# Altium project PCB_3U_RJ45.PrjPCB
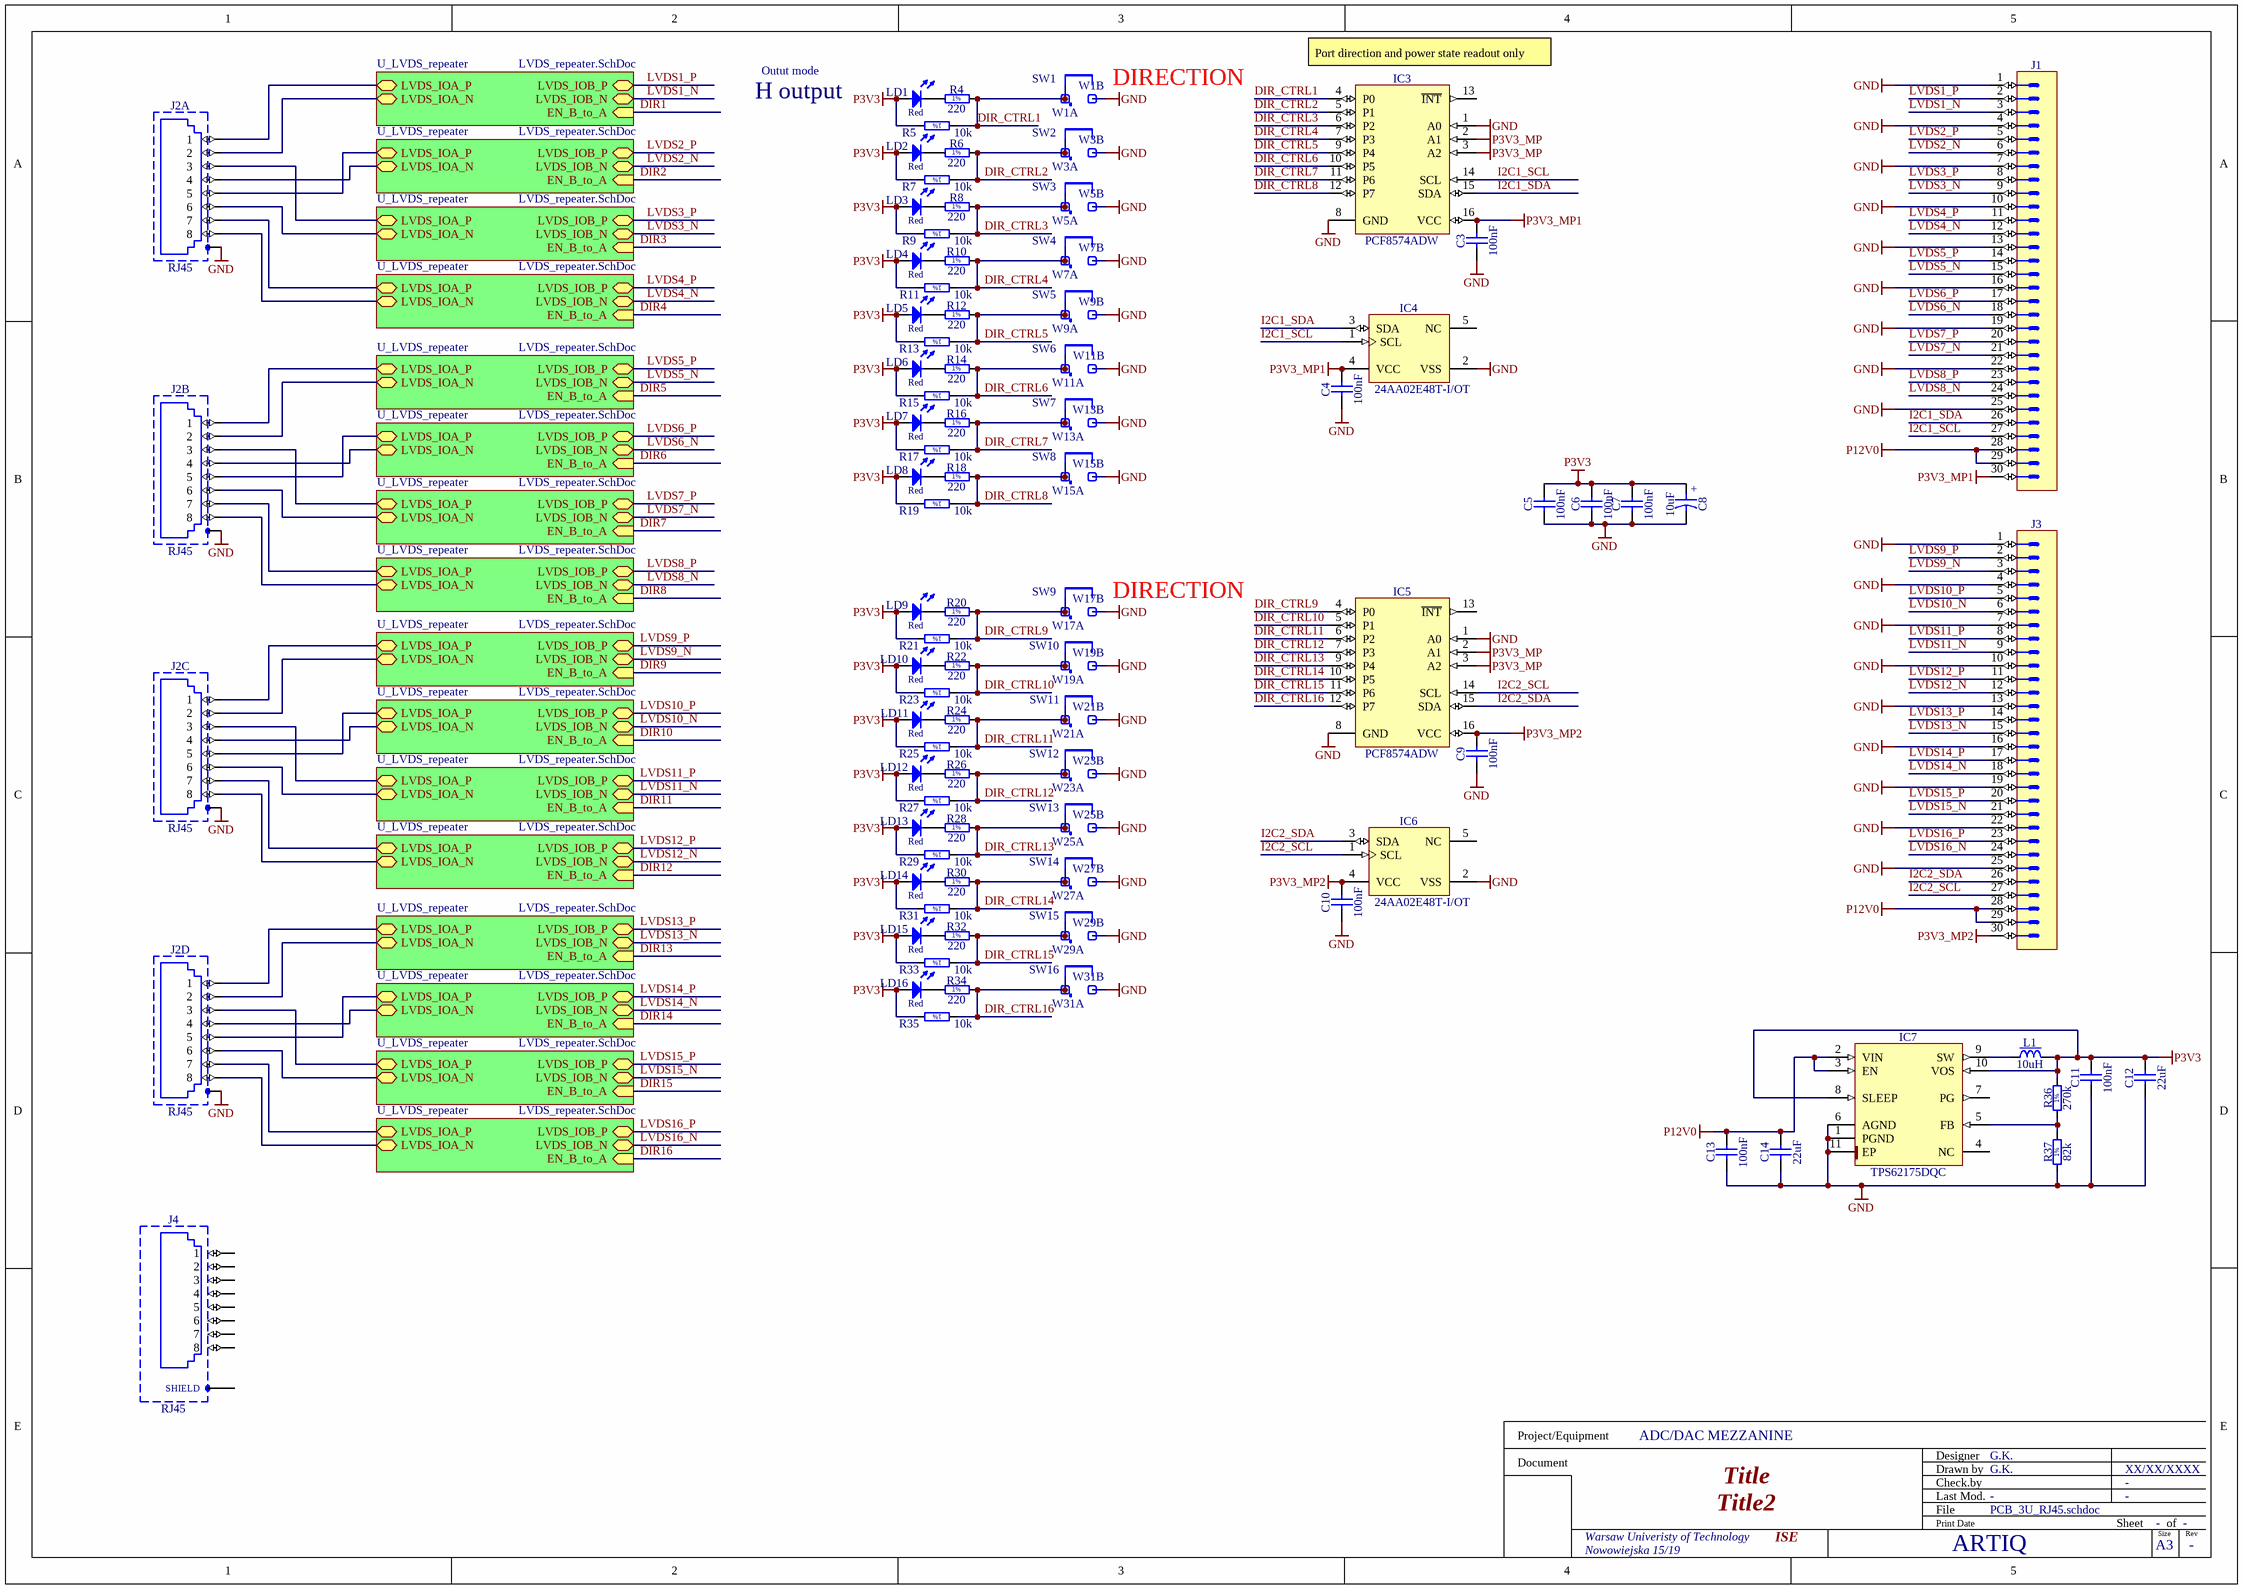
[diagram p0: PCB_3U_RJ45.schdoc]
2 sheets, 232 parts. Net scope: hierarchical (ports join the sheet entries above them; power ports are global).
Board file: PCB_3U_RJ45.PCBDOC
Sheets:
  PCB_3U_RJ45.schdoc
    U_LVDS_repeater = LVDS_repeater.SchDoc
    U_LVDS_repeater = LVDS_repeater.SchDoc
    U_LVDS_repeater = LVDS_repeater.SchDoc
    U_LVDS_repeater = LVDS_repeater.SchDoc
    U_LVDS_repeater = LVDS_repeater.SchDoc
    U_LVDS_repeater = LVDS_repeater.SchDoc
    U_LVDS_repeater = LVDS_repeater.SchDoc
    U_LVDS_repeater = LVDS_repeater.SchDoc
    U_LVDS_repeater = LVDS_repeater.SchDoc
    U_LVDS_repeater = LVDS_repeater.SchDoc
    U_LVDS_repeater = LVDS_repeater.SchDoc
    U_LVDS_repeater = LVDS_repeater.SchDoc
    U_LVDS_repeater = LVDS_repeater.SchDoc
    U_LVDS_repeater = LVDS_repeater.SchDoc
    U_LVDS_repeater = LVDS_repeater.SchDoc
    U_LVDS_repeater = LVDS_repeater.SchDoc

## Sheet PCB_3U_RJ45.schdoc: Title
size 420 x 297 mm; Author: G.K.; CompanyName: WUT; DrawnBy: G.K.; Organization: CERN; Address1: Warsaw Univeristy of Technology; Address2: Nowowiejska 15/19; Revision: -; SheetNumber: -; SheetTotal: -; EDA_Number: ARTIQ; Projet: ADC/DAC MEZZANINE; ModifiedBy: -; CreateDate: XX/XX/XXXX; CheckedDate: -; Title2: Title2; DivGrp: ISE; Designer: G.K.; ModifiedDate: -; ProjectName: ADC/DAC MEZZANINE

### Parts
C3  100nF  [CAPC1005X55N]
C4  100nF  [CAPC1005X55N]
C5  100nF  [CAPC1005X55N]
C6  100nF  [CAPC1005X55N]
C7  100nF  [CAPC1005X55N]
C8  10uF  [CAPAE430X540N]
C9  100nF  [CAPC1005X55N]
C10  100nF  [CAPC1005X55N]
C11  100nF  [CAPC1005X55N]
C12  22uF  [CAPC2012X135N]
C13  100nF  [CAPC1005X55N]
C14  22uF  [CAPC2012X135N]
IC3  PCF8574ADW  [SOIC127P1030X265-16N]
IC4  24AA02E48T-I/OT  [SOT95P280X145-5N]
IC5  PCF8574ADW  [SOIC127P1030X265-16N]
IC6  24AA02E48T-I/OT  [SOT95P280X145-5N]
IC7  TPS62175DQC  [SON50P200X300X80-11N-R94X250]
J1  (no value)  [3M_N2530-6002RB]
J2  RJ45  [TYCO_5406203-3]  (parts A,B,C,D of 4)
J3  (no value)  [3M_N2530-6002RB]
J4  RJ45  [FCI_95678-001LF]
L1  10uH  [IND_MURATA-PS_8400]
LD1  Red  [LED_AVAGO_HSMC-C120]  (value not drawn)
LD2  Red  [LED_AVAGO_HSMC-C120]  (value not drawn)
LD3  Red  [LED_AVAGO_HSMC-C120]  (value not drawn)
LD4  Red  [LED_AVAGO_HSMC-C120]  (value not drawn)
LD5  Red  [LED_AVAGO_HSMC-C120]  (value not drawn)
LD6  Red  [LED_AVAGO_HSMC-C120]  (value not drawn)
LD7  Red  [LED_AVAGO_HSMC-C120]  (value not drawn)
LD8  Red  [LED_AVAGO_HSMC-C120]  (value not drawn)
LD9  Red  [LED_AVAGO_HSMC-C120]  (value not drawn)
LD10  Red  [LED_AVAGO_HSMC-C120]  (value not drawn)
LD11  Red  [LED_AVAGO_HSMC-C120]  (value not drawn)
LD12  Red  [LED_AVAGO_HSMC-C120]  (value not drawn)
LD13  Red  [LED_AVAGO_HSMC-C120]  (value not drawn)
LD14  Red  [LED_AVAGO_HSMC-C120]  (value not drawn)
LD15  Red  [LED_AVAGO_HSMC-C120]  (value not drawn)
LD16  Red  [LED_AVAGO_HSMC-C120]  (value not drawn)
R4  220  [RESC1608X55N]
R5  10k  [RESC1005X40N]
R6  220  [RESC1608X55N]
R7  10k  [RESC1005X40N]
R8  220  [RESC1608X55N]
R9  10k  [RESC1005X40N]
R10  220  [RESC1608X55N]
R11  10k  [RESC1005X40N]
R12  220  [RESC1608X55N]
R13  10k  [RESC1005X40N]
R14  220  [RESC1608X55N]
R15  10k  [RESC1005X40N]
R16  220  [RESC1608X55N]
R17  10k  [RESC1005X40N]
R18  220  [RESC1608X55N]
R19  10k  [RESC1005X40N]
R20  220  [RESC1608X55N]
R21  10k  [RESC1005X40N]
R22  220  [RESC1608X55N]
R23  10k  [RESC1005X40N]
R24  220  [RESC1608X55N]
R25  10k  [RESC1005X40N]
R26  220  [RESC1608X55N]
R27  10k  [RESC1005X40N]
R28  220  [RESC1608X55N]
R29  10k  [RESC1005X40N]
R30  220  [RESC1608X55N]
R31  10k  [RESC1005X40N]
R32  220  [RESC1608X55N]
R33  10k  [RESC1005X40N]
R34  220  [RESC1608X55N]
R35  10k  [RESC1005X40N]
R36  270k  [RESC1608X55N]
R37  82k  [RESC1608X55N]
SW1  Jumper Type1  [JUMPER_BLACK_INSULATED_2.54MM]  (value not drawn)
SW2  Jumper Type1  [JUMPER_BLACK_INSULATED_2.54MM]  (value not drawn)
SW3  Jumper Type1  [JUMPER_BLACK_INSULATED_2.54MM]  (value not drawn)
SW4  Jumper Type1  [JUMPER_BLACK_INSULATED_2.54MM]  (value not drawn)
SW5  Jumper Type1  [JUMPER_BLACK_INSULATED_2.54MM]  (value not drawn)
SW6  Jumper Type1  [JUMPER_BLACK_INSULATED_2.54MM]  (value not drawn)
SW7  Jumper Type1  [JUMPER_BLACK_INSULATED_2.54MM]  (value not drawn)
SW8  Jumper Type1  [JUMPER_BLACK_INSULATED_2.54MM]  (value not drawn)
SW9  Jumper Type1  [JUMPER_BLACK_INSULATED_2.54MM]  (value not drawn)
SW10  Jumper Type1  [JUMPER_BLACK_INSULATED_2.54MM]  (value not drawn)
SW11  Jumper Type1  [JUMPER_BLACK_INSULATED_2.54MM]  (value not drawn)
SW12  Jumper Type1  [JUMPER_BLACK_INSULATED_2.54MM]  (value not drawn)
SW13  Jumper Type1  [JUMPER_BLACK_INSULATED_2.54MM]  (value not drawn)
SW14  Jumper Type1  [JUMPER_BLACK_INSULATED_2.54MM]  (value not drawn)
SW15  Jumper Type1  [JUMPER_BLACK_INSULATED_2.54MM]  (value not drawn)
SW16  Jumper Type1  [JUMPER_BLACK_INSULATED_2.54MM]  (value not drawn)
W1  Test Point  [COMATEL_385.0358.1.02.400]  (value not drawn)  (parts A,B of 2)
W3  Test Point  [COMATEL_385.0358.1.02.400]  (value not drawn)  (parts A,B of 2)
W5  Test Point  [COMATEL_385.0358.1.02.400]  (value not drawn)  (parts A,B of 2)
W7  Test Point  [COMATEL_385.0358.1.02.400]  (value not drawn)  (parts A,B of 2)
W9  Test Point  [COMATEL_385.0358.1.02.400]  (value not drawn)  (parts A,B of 2)
W11  Test Point  [COMATEL_385.0358.1.02.400]  (value not drawn)  (parts A,B of 2)
W13  Test Point  [COMATEL_385.0358.1.02.400]  (value not drawn)  (parts A,B of 2)
W15  Test Point  [COMATEL_385.0358.1.02.400]  (value not drawn)  (parts A,B of 2)
W17  Test Point  [COMATEL_385.0358.1.02.400]  (value not drawn)  (parts A,B of 2)
W19  Test Point  [COMATEL_385.0358.1.02.400]  (value not drawn)  (parts A,B of 2)
W21  Test Point  [COMATEL_385.0358.1.02.400]  (value not drawn)  (parts A,B of 2)
W23  Test Point  [COMATEL_385.0358.1.02.400]  (value not drawn)  (parts A,B of 2)
W25  Test Point  [COMATEL_385.0358.1.02.400]  (value not drawn)  (parts A,B of 2)
W27  Test Point  [COMATEL_385.0358.1.02.400]  (value not drawn)  (parts A,B of 2)
W29  Test Point  [COMATEL_385.0358.1.02.400]  (value not drawn)  (parts A,B of 2)
W31  Test Point  [COMATEL_385.0358.1.02.400]  (value not drawn)  (parts A,B of 2)

### Sub-sheets
U_LVDS_repeater = LVDS_repeater.SchDoc: LVDS_IOA_P (bidir), LVDS_IOA_N (bidir), LVDS_IOB_P (bidir), LVDS_IOB_N (bidir), EN_B_to_A (in)
U_LVDS_repeater = LVDS_repeater.SchDoc: LVDS_IOA_P (bidir), LVDS_IOA_N (bidir), LVDS_IOB_P (bidir), LVDS_IOB_N (bidir), EN_B_to_A (in)
U_LVDS_repeater = LVDS_repeater.SchDoc: LVDS_IOA_P (bidir), LVDS_IOA_N (bidir), LVDS_IOB_P (bidir), LVDS_IOB_N (bidir), EN_B_to_A (in)
U_LVDS_repeater = LVDS_repeater.SchDoc: LVDS_IOA_P (bidir), LVDS_IOA_N (bidir), LVDS_IOB_P (bidir), LVDS_IOB_N (bidir), EN_B_to_A (in)
U_LVDS_repeater = LVDS_repeater.SchDoc: LVDS_IOA_P (bidir), LVDS_IOA_N (bidir), LVDS_IOB_P (bidir), LVDS_IOB_N (bidir), EN_B_to_A (in)
U_LVDS_repeater = LVDS_repeater.SchDoc: LVDS_IOA_P (bidir), LVDS_IOA_N (bidir), LVDS_IOB_P (bidir), LVDS_IOB_N (bidir), EN_B_to_A (in)
U_LVDS_repeater = LVDS_repeater.SchDoc: LVDS_IOA_P (bidir), LVDS_IOA_N (bidir), LVDS_IOB_P (bidir), LVDS_IOB_N (bidir), EN_B_to_A (in)
U_LVDS_repeater = LVDS_repeater.SchDoc: LVDS_IOA_P (bidir), LVDS_IOA_N (bidir), LVDS_IOB_P (bidir), LVDS_IOB_N (bidir), EN_B_to_A (in)
U_LVDS_repeater = LVDS_repeater.SchDoc: LVDS_IOA_P (bidir), LVDS_IOA_N (bidir), LVDS_IOB_P (bidir), LVDS_IOB_N (bidir), EN_B_to_A (in)
U_LVDS_repeater = LVDS_repeater.SchDoc: LVDS_IOA_P (bidir), LVDS_IOA_N (bidir), LVDS_IOB_P (bidir), LVDS_IOB_N (bidir), EN_B_to_A (in)
U_LVDS_repeater = LVDS_repeater.SchDoc: LVDS_IOA_P (bidir), LVDS_IOA_N (bidir), LVDS_IOB_P (bidir), LVDS_IOB_N (bidir), EN_B_to_A (in)
U_LVDS_repeater = LVDS_repeater.SchDoc: LVDS_IOA_P (bidir), LVDS_IOA_N (bidir), LVDS_IOB_P (bidir), LVDS_IOB_N (bidir), EN_B_to_A (in)
U_LVDS_repeater = LVDS_repeater.SchDoc: LVDS_IOA_P (bidir), LVDS_IOA_N (bidir), LVDS_IOB_P (bidir), LVDS_IOB_N (bidir), EN_B_to_A (in)
U_LVDS_repeater = LVDS_repeater.SchDoc: LVDS_IOA_P (bidir), LVDS_IOA_N (bidir), LVDS_IOB_P (bidir), LVDS_IOB_N (bidir), EN_B_to_A (in)
U_LVDS_repeater = LVDS_repeater.SchDoc: LVDS_IOA_P (bidir), LVDS_IOA_N (bidir), LVDS_IOB_P (bidir), LVDS_IOB_N (bidir), EN_B_to_A (in)
U_LVDS_repeater = LVDS_repeater.SchDoc: LVDS_IOA_P (bidir), LVDS_IOA_N (bidir), LVDS_IOB_P (bidir), LVDS_IOB_N (bidir), EN_B_to_A (in)

### Nets
GND: C3.1 C4.1 C5.1 C6.1 C7.1 C8.2 C9.1 C10.1 C11.1 C12.1 C13.1 C14.1 IC3.1(A0) IC3.8(GND) IC4.2(VSS) IC5.1(A0) IC5.8(GND) IC6.2(VSS) IC7.1(PGND) IC7.6(AGND) IC7.11(EP) J1.1 J1.4 J1.7 J1.10 J1.13 J1.16 J1.19 J1.22 J1.25 J2.SH J3.1 J3.4 J3.7 J3.10 J3.13 J3.16 J3.19 J3.22 J3.25 R37.1 W1.2 W3.2 W5.2 W7.2 W9.2 W11.2 W13.2 W15.2 W17.2 W19.2 W21.2 W23.2 W25.2 W27.2 W29.2 W31.2
P3V3: C5.2 C6.2 C7.2 C8.1 C11.2 C12.2 IC7.8(SLEEP) IC7.10(VOS) L1.2 LD1.2(A) LD2.2(A) LD3.2(A) LD4.2(A) LD5.2(A) LD6.2(A) LD7.2(A) LD8.2(A) LD9.2(A) LD10.2(A) LD11.2(A) LD12.2(A) LD13.2(A) LD14.2(A) LD15.2(A) LD16.2(A) R5.2 R7.2 R9.2 R11.2 R13.2 R15.2 R17.2 R19.2 R21.2 R23.2 R25.2 R27.2 R29.2 R31.2 R33.2 R35.2 R36.2
P3V3_MP: IC3.2(A1) IC3.3(A2) IC5.2(A1) IC5.3(A2)
P3V3_MP1: C3.2 C4.2 IC3.16(VCC) IC4.4(VCC) J1.30
P3V3_MP2: C9.2 C10.2 IC5.16(VCC) IC6.4(VCC) J3.30
P12V0: C13.2 C14.2 IC7.2(VIN) IC7.3(EN) J1.28 J1.29 J3.28 J3.29
DIR_CTRL1: IC3.4(P0) R4.2 R5.1 SW1.1 W1.1
DIR_CTRL2: IC3.5(P1) R6.2 R7.1 SW2.1 W3.1
DIR_CTRL3: IC3.6(P2) R8.2 R9.1 SW3.1 W5.1
DIR_CTRL4: IC3.7(P3) R10.2 R11.1 SW4.1 W7.1
DIR_CTRL5: IC3.9(P4) R12.2 R13.1 SW5.1 W9.1
DIR_CTRL6: IC3.10(P5) R14.2 R15.1 SW6.1 W11.1
DIR_CTRL7: IC3.11(P6) R16.2 R17.1 SW7.1 W13.1
DIR_CTRL8: IC3.12(P7) R18.2 R19.1 SW8.1 W15.1
DIR_CTRL9: IC5.4(P0) R20.2 R21.1 SW9.1 W17.1
DIR_CTRL10: IC5.5(P1) R22.2 R23.1 SW10.1 W19.1
DIR_CTRL11: IC5.6(P2) R24.2 R25.1 SW11.1 W21.1
DIR_CTRL12: IC5.7(P3) R26.2 R27.1 SW12.1 W23.1
DIR_CTRL13: IC5.9(P4) R28.2 R29.1 SW13.1 W25.1
DIR_CTRL14: IC5.10(P5) R30.2 R31.1 SW14.1 W27.1
DIR_CTRL15: IC5.11(P6) R32.2 R33.1 SW15.1 W29.1
DIR_CTRL16: IC5.12(P7) R34.2 R35.1 SW16.1 W31.1
I2C1_SCL: IC3.14(SCL) IC4.1(SCL) J1.27
I2C1_SDA: IC3.15(SDA) IC4.3(SDA) J1.26
I2C2_SCL: IC5.14(SCL) IC6.1(SCL) J3.27
I2C2_SDA: IC5.15(SDA) IC6.3(SDA) J3.26
LVDS1_N: J1.3 ; sheet U_LVDS_repeater/LVDS_IOB_N
LVDS1_P: J1.2 ; sheet U_LVDS_repeater/LVDS_IOB_P
LVDS2_N: J1.6 ; sheet U_LVDS_repeater/LVDS_IOB_N
LVDS2_P: J1.5 ; sheet U_LVDS_repeater/LVDS_IOB_P
LVDS3_N: J1.9 ; sheet U_LVDS_repeater/LVDS_IOB_N
LVDS3_P: J1.8 ; sheet U_LVDS_repeater/LVDS_IOB_P
LVDS4_N: J1.12 ; sheet U_LVDS_repeater/LVDS_IOB_N
LVDS4_P: J1.11 ; sheet U_LVDS_repeater/LVDS_IOB_P
LVDS5_N: J1.15 ; sheet U_LVDS_repeater/LVDS_IOB_N
LVDS5_P: J1.14 ; sheet U_LVDS_repeater/LVDS_IOB_P
LVDS6_N: J1.18 ; sheet U_LVDS_repeater/LVDS_IOB_N
LVDS6_P: J1.17 ; sheet U_LVDS_repeater/LVDS_IOB_P
LVDS7_N: J1.21 ; sheet U_LVDS_repeater/LVDS_IOB_N
LVDS7_P: J1.20 ; sheet U_LVDS_repeater/LVDS_IOB_P
LVDS8_N: J1.24 ; sheet U_LVDS_repeater/LVDS_IOB_N
LVDS8_P: J1.23 ; sheet U_LVDS_repeater/LVDS_IOB_P
LVDS9_N: J3.3 ; sheet U_LVDS_repeater/LVDS_IOB_N
LVDS9_P: J3.2 ; sheet U_LVDS_repeater/LVDS_IOB_P
LVDS10_N: J3.6 ; sheet U_LVDS_repeater/LVDS_IOB_N
LVDS10_P: J3.5 ; sheet U_LVDS_repeater/LVDS_IOB_P
LVDS11_N: J3.9 ; sheet U_LVDS_repeater/LVDS_IOB_N
LVDS11_P: J3.8 ; sheet U_LVDS_repeater/LVDS_IOB_P
LVDS12_N: J3.12 ; sheet U_LVDS_repeater/LVDS_IOB_N
LVDS12_P: J3.11 ; sheet U_LVDS_repeater/LVDS_IOB_P
LVDS13_N: J3.15 ; sheet U_LVDS_repeater/LVDS_IOB_N
LVDS13_P: J3.14 ; sheet U_LVDS_repeater/LVDS_IOB_P
LVDS14_N: J3.18 ; sheet U_LVDS_repeater/LVDS_IOB_N
LVDS14_P: J3.17 ; sheet U_LVDS_repeater/LVDS_IOB_P
LVDS15_N: J3.21 ; sheet U_LVDS_repeater/LVDS_IOB_N
LVDS15_P: J3.20 ; sheet U_LVDS_repeater/LVDS_IOB_P
LVDS16_N: J3.24 ; sheet U_LVDS_repeater/LVDS_IOB_N
LVDS16_P: J3.23 ; sheet U_LVDS_repeater/LVDS_IOB_P
NetIC1A_5: J2.8D(8) ; sheet U_LVDS_repeater/LVDS_IOA_N
NetIC1A_6: J2.7D(7) ; sheet U_LVDS_repeater/LVDS_IOA_P
NetIC1B_5: J2.6D(6) ; sheet U_LVDS_repeater/LVDS_IOA_N
NetIC1B_6: J2.3D(3) ; sheet U_LVDS_repeater/LVDS_IOA_P
NetIC1C_5: J2.4D(4) ; sheet U_LVDS_repeater/LVDS_IOA_N
NetIC1C_6: J2.5D(5) ; sheet U_LVDS_repeater/LVDS_IOA_P
NetIC1D_5: J2.2D(2) ; sheet U_LVDS_repeater/LVDS_IOA_N
NetIC1D_6: J2.1D(1) ; sheet U_LVDS_repeater/LVDS_IOA_P
NetIC1E_5: J2.8C(8) ; sheet U_LVDS_repeater/LVDS_IOA_N
NetIC1E_6: J2.7C(7) ; sheet U_LVDS_repeater/LVDS_IOA_P
NetIC1F_5: J2.6C(6) ; sheet U_LVDS_repeater/LVDS_IOA_N
NetIC1F_6: J2.3C(3) ; sheet U_LVDS_repeater/LVDS_IOA_P
NetIC1G_5: J2.4C(4) ; sheet U_LVDS_repeater/LVDS_IOA_N
NetIC1G_6: J2.5C(5) ; sheet U_LVDS_repeater/LVDS_IOA_P
NetIC1H_5: J2.2C(2) ; sheet U_LVDS_repeater/LVDS_IOA_N
NetIC1H_6: J2.1C(1) ; sheet U_LVDS_repeater/LVDS_IOA_P
NetIC1I_5: J2.8B(8) ; sheet U_LVDS_repeater/LVDS_IOA_N
NetIC1I_6: J2.7B(7) ; sheet U_LVDS_repeater/LVDS_IOA_P
NetIC1J_5: J2.6B(6) ; sheet U_LVDS_repeater/LVDS_IOA_N
NetIC1J_6: J2.3B(3) ; sheet U_LVDS_repeater/LVDS_IOA_P
NetIC1K_5: J2.4B(4) ; sheet U_LVDS_repeater/LVDS_IOA_N
NetIC1K_6: J2.5B(5) ; sheet U_LVDS_repeater/LVDS_IOA_P
NetIC1L_5: J2.2B(2) ; sheet U_LVDS_repeater/LVDS_IOA_N
NetIC1L_6: J2.1B(1) ; sheet U_LVDS_repeater/LVDS_IOA_P
NetIC1M_5: J2.8A(8) ; sheet U_LVDS_repeater/LVDS_IOA_N
NetIC1M_6: J2.7A(7) ; sheet U_LVDS_repeater/LVDS_IOA_P
NetIC1N_5: J2.6A(6) ; sheet U_LVDS_repeater/LVDS_IOA_N
NetIC1N_6: J2.3A(3) ; sheet U_LVDS_repeater/LVDS_IOA_P
NetIC1O_5: J2.4A(4) ; sheet U_LVDS_repeater/LVDS_IOA_N
NetIC1O_6: J2.5A(5) ; sheet U_LVDS_repeater/LVDS_IOA_P
NetIC1P_5: J2.2A(2) ; sheet U_LVDS_repeater/LVDS_IOA_N
NetIC1P_6: J2.1A(1) ; sheet U_LVDS_repeater/LVDS_IOA_P
NetIC7_5: IC7.5(FB) R36.1 R37.2
NetIC7_9: IC7.9(SW) L1.1
NetLD1_1: LD1.1(C) R4.1
NetLD2_1: LD2.1(C) R6.1
NetLD3_1: LD3.1(C) R8.1
NetLD4_1: LD4.1(C) R10.1
NetLD5_1: LD5.1(C) R12.1
NetLD6_1: LD6.1(C) R14.1
NetLD7_1: LD7.1(C) R16.1
NetLD8_1: LD8.1(C) R18.1
NetLD9_1: LD9.1(C) R20.1
NetLD10_1: LD10.1(C) R22.1
NetLD11_1: LD11.1(C) R24.1
NetLD12_1: LD12.1(C) R26.1
NetLD13_1: LD13.1(C) R28.1
NetLD14_1: LD14.1(C) R30.1
NetLD15_1: LD15.1(C) R32.1
NetLD16_1: LD16.1(C) R34.1

Not connected (* = marked no-connect by the designer): IC3 13(~{INT}); IC4 5(NC); IC5 13(~{INT}); IC6 5(NC); IC7 4(NC) 7(PG); J4 1 2 3 4 5 6 7 8 SHIELD

### Notes on the sheet
- H output
- Outut mode
- (near W1) DIRECTION
- (near IC3) Port direction and power state readout only
- (near W17) DIRECTION
- Project/Equipment
- Document
- Designer
- Drawn by
- Check.by
- File
- Last Mod.
- Print Date
- Sheet
- Size
- A3
- of
- Rev
- (in symbol CAE430-540_10UF_16V_20%) +
- (in symbol R0402_10K_1%_0.0625W_100PPM) 1%
- (in symbol R0603_82K_1%_0.1W_100PPM) 1%
- (in symbol R0603_220R_1%_0.1W_100PPM) 1%
- (in symbol R0603_270K_1%_0.1W_100PPM) 1%

### Library data of the parts
C3-C7 C9-C11 C13 = CC0402_100NF_16V_10%_X5R: Non-polarised capacitor; Part Description: SMD Multilayer Chip Ceramic Capacitor; Manufacturer: GENERIC; Manufacturer1 Part Number: GRM155R61C104KA88D; Voltage: 16V; TC: X5R; Tolerance: ±10%; Part Number: CC0402_100NF_16V_10%_X5R; Component Kind: Standard; Component Type: Standard; Pin Count: 2; Value: 100nF; Status: None; Manufacturer Part Number: CC0402_100NF_16V_10%_X5R; Case: 0402; Mounted: Yes; Socket: No; SMD: Yes; Sense: No; Manufacturer1 Example: MURATA; Manufacturer1 ComponentHeight: 0.55mm; HelpURL: \\cern.ch\dfs\Applications\Altium\Datasheets\CC0402_X5R_MURATA_GRM.pdf; Author: CERN DEM JLC; CreateDate: 10.12.2013; LatestRevisionDate: 10.12.2013
C8 = CAE430-540_10UF_16V_20%: Polarised capacitor; Part Description: Aluminum Electrolytic SMT Capacitor; Manufacturer: PANASONIC; Manufacturer Part Number: EEEFK1C100AR; Voltage: 16V; Tolerance: ±20%; Part Number: CAE430-540_10UF_16V_20%; Component Kind: Standard; Component Type: Standard; Pin Count: 2; Value: 10uF; Status: Not Recommended; Case: B; Mounted: Yes; Socket: No; SMD: Yes; Sense: No; ComponentHeight: 5.8mm; HelpURL: \\cern.ch\dfs\Applications\Altium\Datasheets\CAE_PANASONIC_FK.pdf; Author: CERN DEM JLC; CreateDate: 03.12.2007; LatestRevisionDate: 05.11.2014
C12 C14 = CC0805_22UF_16V_10%_X5R: Non-polarised capacitor; Part Description: SMD Multilayer Chip Ceramic Capacitor; Manufacturer: GENERIC; Manufacturer1 Part Number: C2012X5R1C226KT; Voltage: 16V; TC: X5R; Tolerance: ±10%; Part Number: CC0805_22UF_16V_10%_X5R; Component Kind: Standard; Component Type: Standard; Pin Count: 2; Value: 22uF; Status: Preferred; Manufacturer Part Number: CC0805_22UF_16V_10%_X5R; Case: 0805; Mounted: Yes; Socket: No; SMD: Yes; Sense: No; Manufacturer1 Example: TDK; Manufacturer1 ComponentHeight: 1.35mm; HelpURL: \\cern.ch\dfs\Applications\Altium\Datasheets\CC0805_X5R_TDK_C.pdf; Author: CERN DEM JLC; CreateDate: 25.10.2012; LatestRevisionDate: 25.10.2012
IC3 IC5 = PCF8574ADW: Remote 8-bit I/O Expander For I2C Bus; Manufacturer: TEXAS INSTRUMENTS; PressFit: No; Bonding: No; Part Number: PCF8574ADW; Component Kind: Standard; Component Type: Standard; Device: PCF8574ADW; PackageDescription: SOIC 16, Pitch 1.27mm - Body 7.5x10.3mm, IPC Medium Density; Part Description: Remote 8-bit I/O Expander For I2C Bus; Manufacturer Part Number: PCF8574ADW; Pin Count: 16; Case: SOIC16W; Mounted: Yes; Socket: No; SMD: Yes; Sense: No; ComponentHeight: 2.65mm; Author: CERN DEM JLC; HelpURL: \\cern.ch\dfs\Applications\Altium\Datasheets\PCF8574ADW.pdf; CreateDate: 01.11.2012; LatestRevisionDate: 01.11.2012
IC4 IC6 = 24AA02E48T-I/OT: 1.7V-5.5V, 2K I2C Serial EEPROM With EUI-48 Node Identity; Manufacturer: MICROCHIP TECHNOLOGY; PressFit: No; Bonding: No; Part Number: 24AA02E48T-I/OT; Component Kind: Standard; Component Type: Standard; Device: 24AA02E48T-I/OT; PackageDescription: SOT, 0.95mm pitch; 5 pin, 1.60mm W X 2.90mm L X 1.45mm H body, IPC Medium Density; Part Description: 1.7V-5.5V, 2K I2C Serial EEPROM With EUI-48 Node Identity; Manufacturer Part Number: 24AA02E48T-I/OT; Pin Count: 5; Case: SOT23-5; Mounted: Yes; Socket: No; SMD: Yes; Sense: No; ComponentHeight: 1.45mm; HelpURL: \\cern.ch\dfs\Applications\Altium\Datasheets\24AA02E48T-I-OT.pdf; Author: CERN DEM MR; CreateDate: 31.03.2016; LatestRevisionDate: 31.03.2016
IC7 = TPS62175DQC: 4.75-28VDC to 1-6VDC, 500mA Step-Down Converter With Sleep Mode; Manufacturer: TEXAS INSTRUMENTS; PressFit: No; Bonding: No; Part Number: TPS62175DQC; Component Kind: Standard; Component Type: Standard; Device: TPS62175DQC; PackageDescription: SON, 10-Leads, Body 2x3mm, Pitch 0.5mm, Thermal Pad 0.94x2.5mm, IPC Medium Density; Part Description: 4.75-28VDC to 1-6VDC, 500mA Step-Down Converter With Sleep Mode; Manufacturer Part Number: TPS62175DQC; Pin Count: 11; Case: SON10; Mounted: Yes; Socket: No; SMD: Yes; Sense: No; ComponentHeight: 0.8mm; HelpURL: \\cern.ch\dfs\Applications\Altium\Datasheets\TPS62175DQC.pdf; Author: CERN DEM JMW; CreateDate: 11.08.2015; LatestRevisionDate: 11.08.2015
J1 J3 = 3M_N2530-6002RB: Connector 30 Male; Part Description: 30 Contacts - Straight .100'' x .100'' Low Profile Four-Wall Header, 2500 Series; Manufacturer: 3M; PressFit: No; Part Number: 3M_N2530-6002RB; Component Kind: Standard; Component Type: Standard; Pin Count: 30; Family: Header 30; Mounted: Yes; Socket: No; SMD: No; Sense: No; Status: None; Manufacturer Part Number: N2530-6002RB; ComponentHeight: 10.03mm; HelpURL: \\cern.ch\dfs\Applications\Altium\Datasheets\3M_N2530-6002RB.pdf; Author: CERN DEM JLC; CreateDate: 11.02.2009; LatestRevisionDate: 11.08.2009
J2 = TYCO_5406203-3: Connector 4 x RJ45 + Shield; Part Description: Modular RJ45 Jack, 4 Port, 8 Positions, Shielded, Reverse Panel Ground Tabs, Category 5; Manufacturer: TYCO ELECTRONICS; PressFit: No; Part Number: TYCO_5406203-3; Component Kind: Standard; Component Type: Standard; Pin Count: 33; Family: RJ45; Mounted: Yes; Socket: No; SMD: No; Sense: No; Status: None; Manufacturer Part Number: 5406203-3; ComponentHeight: 13.64mm; HelpURL: \\cern.ch\dfs\Applications\Altium\Datasheets\TYCO_5406203-3.pdf; Author: CERN DEM JLC; CreateDate: 30.10.2008; LatestRevisionDate: 30.10.2008
J4 = FCI_95678-001LF: 1 Port, 8 Positions Shielded Snap PEG, CAT5 RJ45 Horizontal Modular Jack; Manufacturer: FCI; PressFit: No; Part Number: FCI_95678-001LF; Component Kind: Standard; Component Type: Standard; Pin Count: 10; Family: RJ45; Mounted: Yes; Socket: No; SMD: No; Sense: No; Status: None; Part Description: 1 Port, 8 Positions Shielded Snap PEG, CAT5 RJ45 Horizontal Modular Jack; Manufacturer Part Number: 95678-001LF; ComponentHeight: 13.99mm; HelpURL: \\cern.ch\dfs\Applications\Altium\Datasheets\FCI_95678-001LF.pdf; Author: CERN DEM BC; CreateDate: 28.07.2015; LatestRevisionDate: 28.07.2015
L1 = IND_10UH_10%_MURATA-PS_8400: Inductor With Core; Part Description: Miniature Surface Mount Power Inductor (8400 Serie); Manufacturer: MURATA POWER SOLUTIONS; Manufacturer Part Number: 84103C; Power: 950mA; Resistance: 0.24R; Tolerance: ±10%; Part Number: IND_10UH_10%_MURATA-PS_8400; Component Kind: Standard; Component Type: Standard; Pin Count: 2; Value: 10uH; Status: None; Mounted: Yes; Socket: No; SMD: Yes; Sense: No; ComponentHeight: 2.9mm; HelpURL: \\cern.ch\dfs\Applications\Altium\Datasheets\IND_MURATA-PS_8400.pdf; Author: CERN DEM JLC; CreateDate: 02.07.2012; LatestRevisionDate: 02.07.2012
LD1-LD16 = LED_AVAGO_HSMC-C120: LED Red 1C 2A; Part Description: High Performance Right Angle Chip Red LED; Manufacturer: AVAGO TECHNOLOGIES; PressFit: No; Bonding: No; Part Number: LED_AVAGO_HSMC-C120; Component Kind: Standard; Component Type: Standard; Color: Red; PackageDescription: Red Chip LED, 2-Leads, Body 1.7x1.1mm, Side Emitting Package; Manufacturer Part Number: HSMC-C120; Pin Count: 2; Mounted: Yes; Socket: No; SMD: Yes; Sense: No; ComponentHeight: 0.7mm; HelpURL: \\cern.ch\dfs\Applications\Altium\Datasheets\LED_AVAGO_HSMC-C120.pdf; ComponentLink1URL: \\cern.ch\dfs\Applications\Altium\Datasheets\LED_AVAGO_HSMC-C120_DESIGN-GUIDE.pdf; ComponentLink1Description: Design Guide; Author: CERN DEM JMW; CreateDate: 22.07.2009; LatestRevisionDate: 20.06.2012
R4 R6 R8 R10 R12 R14 R16 R18 R20 R22 R24 R26 R28 R30 R32 R34 = R0603_220R_1%_0.1W_100PPM: Resistor - 1%; Part Description: General Purpose Thick Film Chip Resistor; Manufacturer: GENERIC; Manufacturer1 Part Number: NRC06F2200TRF; Power: 0.1W; TC: ±100ppm/°C; Part Number: R0603_220R_1%_0.1W_100PPM; Component Kind: Standard; Component Type: Standard; Pin Count: 2; Value: 220; Status: Preferred; Tolerance: ±1%; Manufacturer Part Number: R0603_220R_1%_0.1W_100PPM; Case: 0603; Mounted: Yes; Sense: No; Socket: No; SMD: Yes; Manufacturer1 Example: NIC COMPONENT; Manufacturer1 ComponentHeight: 0.55mm; HelpURL: \\cern.ch\dfs\Applications\Altium\Datasheets\R0603_NIC_NRC.pdf; Author: CERN DEM JLC; CreateDate: 03.12.2007; LatestRevisionDate: 13.03.2008
R5 R7 R9 R11 R13 R15 R17 R19 R21 R23 R25 R27 R29 R31 R33 R35 = R0402_10K_1%_0.0625W_100PPM: Resistor - 1%; Part Description: General Purpose Thick Film Chip Resistor; Manufacturer: GENERIC; Manufacturer1 Part Number: 232270671003L; TC: ±100ppm/°C; Part Number: R0402_10K_1%_0.0625W_100PPM; Component Kind: Standard; Component Type: Standard; Pin Count: 2; Value: 10k; Status: Not recommended; Power: 0.0625W; Tolerance: ±1%; Manufacturer Part Number: R0402_10K_1%_0.0625W_100PPM; Case: 0402; Mounted: Yes; Sense: No; Socket: No; SMD: Yes; Manufacturer1 Example: YAGEO PHYCOMP; Manufacturer1 ComponentHeight: 0.4mm; HelpURL: \\cern.ch\dfs\Applications\Altium\Datasheets\R0402_Phycomp_RC0402.pdf; Author: CERN DEM JLC; CreateDate: 03.12.2007; LatestRevisionDate: 17.10.2012
R36 = R0603_270K_1%_0.1W_100PPM: Resistor - 1%; Part Description: General Purpose Thick Film Chip Resistor; Manufacturer: GENERIC; Manufacturer1 Part Number: NRC06F2703TRF; Power: 0.1W; TC: ±100ppm/°C; Part Number: R0603_270K_1%_0.1W_100PPM; Component Kind: Standard; Component Type: Standard; Pin Count: 2; Value: 270k; Status: Preferred; Tolerance: ±1%; Manufacturer Part Number: R0603_270K_1%_0.1W_100PPM; Case: 0603; Mounted: Yes; Sense: No; Socket: No; SMD: Yes; Manufacturer1 Example: NIC COMPONENT; Manufacturer1 ComponentHeight: 0.55mm; HelpURL: \\cern.ch\dfs\Applications\Altium\Datasheets\R0603_NIC_NRC.pdf; Author: CERN DEM JLC; CreateDate: 03.12.2007; LatestRevisionDate: 13.03.2008
R37 = R0603_82K_1%_0.1W_100PPM: Resistor - 1%; Part Description: General Purpose Thick Film Chip Resistor; Manufacturer: GENERIC; Manufacturer1 Part Number: NRC06F8202TRF; Power: 0.1W; TC: ±100ppm/°C; Part Number: R0603_82K_1%_0.1W_100PPM; Component Kind: Standard; Component Type: Standard; Pin Count: 2; Value: 82k; Status: Preferred; Tolerance: ±1%; Manufacturer Part Number: R0603_82K_1%_0.1W_100PPM; Case: 0603; Mounted: Yes; Sense: No; Socket: No; SMD: Yes; Manufacturer1 Example: NIC COMPONENT; Manufacturer1 ComponentHeight: 0.55mm; HelpURL: \\cern.ch\dfs\Applications\Altium\Datasheets\R0603_NIC_NRC.pdf; Author: CERN DEM JLC; CreateDate: 03.12.2007; LatestRevisionDate: 13.03.2008
SW1-SW16 = COMATEL_313.1730.0.00.40.0: Jumper 1 Pin; Part Description: Closed Insulated Black Jumper Pitch 2.54mm; Manufacturer: KONTEK COMATEL; PressFit: No; SCEM: 09.55.10.960.9; Part Number: COMATEL_313.1730.0.00.40.0; Component Kind: Standard; Component Type: Standard; Pin Count: 1; Family: Jumper; Mounted: Yes; Socket: No; SMD: No; Sense: No; Status: Obsolete; Manufacturer Part Number: 313.1730.0.00.40.0; ComponentHeight: 6.5mm; HelpURL: \\cern.ch\dfs\Applications\Altium\Datasheets\COMATEL_313.1730.0.00.40.0.pdf; Author: CERN DEM JLC; CreateDate: 09.04.2008; LatestRevisionDate: 27.08.2013
W1 W3 W5 W7 W9 W11 W13 W15 W17 W19 W21 W23 W25 W27 W29 W31 = COMATEL_385.0358.1.02.400: 2 Mini Wire-Wrap Contact Strip Header; Part Description: 2 Contacts Straight Strip Header Pitch 2.54mm L=6.3mm ''Mini-Wire-Wrap''; Manufacturer: KONTEK COMATEL; PressFit: No; Part Number: COMATEL_385.0358.1.02.400; Component Kind: Standard; Component Type: Standard; Pin Count: 2; Family: Test Point; Mounted: Yes; Socket: No; SMD: No; Sense: No; Status: Not recommended; Manufacturer Part Number: 385.0358.1.02.400; ComponentHeight: 8mm; HelpURL: \\cern.ch\dfs\Applications\Altium\Datasheets\COMATEL_385.0358.1.02.400.pdf; Author: CERN DEM JLC; CreateDate: 30.06.2010; LatestRevisionDate: 10.10.2012

## Sheet LVDS_repeater.SchDoc
size A4
Used 16 times, as channels U_LVDS_repeater, U_LVDS_repeater, U_LVDS_repeater, U_LVDS_repeater, U_LVDS_repeater, U_LVDS_repeater, U_LVDS_repeater, U_LVDS_repeater, U_LVDS_repeater, U_LVDS_repeater, U_LVDS_repeater, U_LVDS_repeater, U_LVDS_repeater, U_LVDS_repeater, U_LVDS_repeater, U_LVDS_repeater. Parts and nets are listed once, with the designators drawn on the sheet.
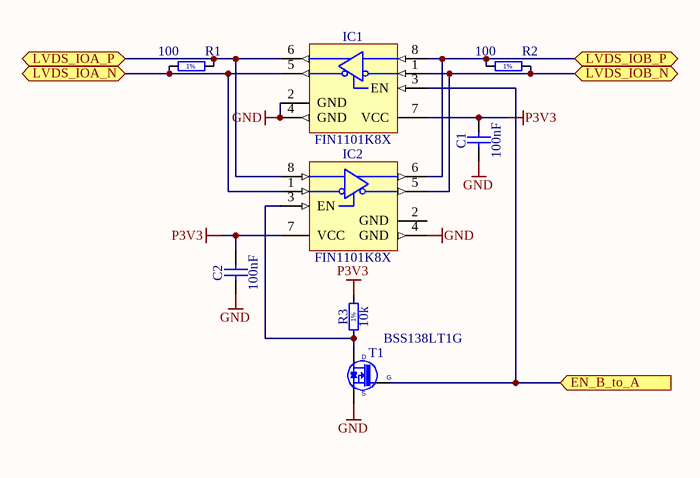
[diagram p1: LVDS_repeater.SchDoc]

### Parts
C1  100nF  [CAPC1005X55N]
C2  100nF  [CAPC1005X55N]
IC1  FIN1101K8X  [SOP50P310X90-8N]
IC2  FIN1101K8X  [SOP50P310X90-8N]
R1  100  [RESC1005X40N]
R2  100  [RESC1005X40N]
R3  10k  [RESC1005X40N]
T1  BSS138LT1G  [SOT95P240X110-3N]

### Ports
EN_B_to_A (in), LVDS_IOA_N (bidir), LVDS_IOA_P (bidir), LVDS_IOB_N (bidir), LVDS_IOB_P (bidir)

### Nets
GND: C1.1 C2.1 IC1.2(GND) IC1.4(GND) IC2.4(GND) T1.2(S)
P3V3: C1.2 C2.2 IC1.7(VCC) IC2.7(VCC) R3.2
EN_B_to_A: IC1.3(EN) T1.1(G) ; port EN_B_to_A
LVDS_IOA_N: IC1.5(DOUT-) IC2.1(RIN-) R1.1 ; port LVDS_IOA_N
LVDS_IOA_P: IC1.6(DOUT+) IC2.8(RIN+) R1.2 ; port LVDS_IOA_P
LVDS_IOB_N: IC1.1(RIN-) IC2.5(DOUT-) R2.2 ; port LVDS_IOB_N
LVDS_IOB_P: IC1.8(RIN+) IC2.6(DOUT+) R2.1 ; port LVDS_IOB_P
NetIC2_3: IC2.3(EN) R3.1 T1.3(D)

Not connected (* = marked no-connect by the designer): IC2 2(GND)

### Channels
U_LVDS_repeater: designators end in P; ports EN_B_to_A=DIR1 LVDS_IOA_N=NetIC1P_5 LVDS_IOA_P=NetIC1P_6 LVDS_IOB_N=LVDS1_N LVDS_IOB_P=LVDS1_P
U_LVDS_repeater: designators end in O; ports EN_B_to_A=DIR2 LVDS_IOA_N=NetIC1O_5 LVDS_IOA_P=NetIC1O_6 LVDS_IOB_N=LVDS2_N LVDS_IOB_P=LVDS2_P
U_LVDS_repeater: designators end in N; ports EN_B_to_A=DIR3 LVDS_IOA_N=NetIC1N_5 LVDS_IOA_P=NetIC1N_6 LVDS_IOB_N=LVDS3_N LVDS_IOB_P=LVDS3_P
U_LVDS_repeater: designators end in M; ports EN_B_to_A=DIR4 LVDS_IOA_N=NetIC1M_5 LVDS_IOA_P=NetIC1M_6 LVDS_IOB_N=LVDS4_N LVDS_IOB_P=LVDS4_P
U_LVDS_repeater: designators end in L; ports EN_B_to_A=DIR5 LVDS_IOA_N=NetIC1L_5 LVDS_IOA_P=NetIC1L_6 LVDS_IOB_N=LVDS5_N LVDS_IOB_P=LVDS5_P
U_LVDS_repeater: designators end in K; ports EN_B_to_A=DIR6 LVDS_IOA_N=NetIC1K_5 LVDS_IOA_P=NetIC1K_6 LVDS_IOB_N=LVDS6_N LVDS_IOB_P=LVDS6_P
U_LVDS_repeater: designators end in J; ports EN_B_to_A=DIR7 LVDS_IOA_N=NetIC1J_5 LVDS_IOA_P=NetIC1J_6 LVDS_IOB_N=LVDS7_N LVDS_IOB_P=LVDS7_P
U_LVDS_repeater: designators end in I; ports EN_B_to_A=DIR8 LVDS_IOA_N=NetIC1I_5 LVDS_IOA_P=NetIC1I_6 LVDS_IOB_N=LVDS8_N LVDS_IOB_P=LVDS8_P
U_LVDS_repeater: designators end in H; ports EN_B_to_A=DIR9 LVDS_IOA_N=NetIC1H_5 LVDS_IOA_P=NetIC1H_6 LVDS_IOB_N=LVDS9_N LVDS_IOB_P=LVDS9_P
U_LVDS_repeater: designators end in G; ports EN_B_to_A=DIR10 LVDS_IOA_N=NetIC1G_5 LVDS_IOA_P=NetIC1G_6 LVDS_IOB_N=LVDS10_N LVDS_IOB_P=LVDS10_P
U_LVDS_repeater: designators end in F; ports EN_B_to_A=DIR11 LVDS_IOA_N=NetIC1F_5 LVDS_IOA_P=NetIC1F_6 LVDS_IOB_N=LVDS11_N LVDS_IOB_P=LVDS11_P
U_LVDS_repeater: designators end in E; ports EN_B_to_A=DIR12 LVDS_IOA_N=NetIC1E_5 LVDS_IOA_P=NetIC1E_6 LVDS_IOB_N=LVDS12_N LVDS_IOB_P=LVDS12_P
U_LVDS_repeater: designators end in D; ports EN_B_to_A=DIR13 LVDS_IOA_N=NetIC1D_5 LVDS_IOA_P=NetIC1D_6 LVDS_IOB_N=LVDS13_N LVDS_IOB_P=LVDS13_P
U_LVDS_repeater: designators end in C; ports EN_B_to_A=DIR14 LVDS_IOA_N=NetIC1C_5 LVDS_IOA_P=NetIC1C_6 LVDS_IOB_N=LVDS14_N LVDS_IOB_P=LVDS14_P
U_LVDS_repeater: designators end in B; ports EN_B_to_A=DIR15 LVDS_IOA_N=NetIC1B_5 LVDS_IOA_P=NetIC1B_6 LVDS_IOB_N=LVDS15_N LVDS_IOB_P=LVDS15_P
U_LVDS_repeater: designators end in A; ports EN_B_to_A=DIR16 LVDS_IOA_N=NetIC1A_5 LVDS_IOA_P=NetIC1A_6 LVDS_IOB_N=LVDS16_N LVDS_IOB_P=LVDS16_P

### Notes on the sheet
- (in symbol R0402_10K_1%_0.0625W_100PPM) 1%
- (in symbol R0402_100R_1%_0.1W_100PPM) 1%

### Library data of the parts
C1 C2 = CC0402_100NF_16V_10%_X5R: as C3 on sheet PCB_3U_RJ45; Part Number: CC0402_100NF_16V_10%_X5R; Component Kind: Standard; Component Type: Standard; Pin Count: 2; Value: 100nF; Status: None; Manufacturer Part Number: CC0402_100NF_16V_10%_X5R; Case: 0402; Mounted: Yes; Socket: No; SMD: Yes; Sense: No; Manufacturer1 Example: MURATA; Manufacturer1 ComponentHeight: 0.55mm; HelpURL: \\cern.ch\dfs\Applications\Altium\Datasheets\CC0402_X5R_MURATA_GRM.pdf; Author: CERN DEM JLC; CreateDate: 10.12.2013; LatestRevisionDate: 10.12.2013
IC1 IC2 = FIN1101K8X: LVDS Single Port High Speed Repeater; Manufacturer: FAIRCHILD SEMICONDUCTOR; PressFit: No; Bonding: No; Part Number: FIN1101K8X; Component Kind: Standard; Component Type: Standard; Device: FIN1101K8X; PackageDescription: SOP, 0.50mm Pitch; 8 pin, 2.30mm W X 2.00mm L X 0.90mm H body, PC Medium Density; Part Description: LVDS Single Port High Speed Repeater; Manufacturer Part Number: FIN1101K8X; Pin Count: 8; Case: TSSOP8; Mounted: Yes; Socket: No; SMD: Yes; Sense: No; ComponentHeight: 0.8mm; Author: CERN DEM JLC; HelpURL: \\cern.ch\dfs\Applications\Altium\Datasheets\FIN1101K8X.pdf; CreateDate: 08.11.2016; LatestRevisionDate: 08.11.2016
R1 R2 = R0402_100R_1%_0.1W_100PPM: Resistor - 1%; Part Description: General Purpose Thick Film Chip Resistor; Manufacturer: GENERIC; Manufacturer Part Number: R0402_100R_1%_0.1W_100PPM_50V; Manufacturer1 Part Number: ERJ2RKF1000X; Power: 0.1W; TC: ±100ppm/°C; Voltage: 50V; Part Number: R0402_100R_1%_0.1W_100PPM; Component Kind: Standard; Component Type: Standard; Pin Count: 2; Value: 100; Status: Not recommended; Tolerance: ±1%; Case: 0402; Mounted: Yes; Sense: No; Socket: No; SMD: Yes; Manufacturer1 Example: PANASONIC; Manufacturer1 ComponentHeight: 0.4mm; HelpURL: \\cern.ch\dfs\Applications\Altium\Datasheets\R0402_PANASONIC_ERJ2RK.pdf; Author: CERN DEM JLC; CreateDate: 12.12.2013; LatestRevisionDate: 03.03.2015
R3 = R0402_10K_1%_0.0625W_100PPM: as R5 on sheet PCB_3U_RJ45; Part Number: R0402_10K_1%_0.0625W_100PPM; Component Kind: Standard; Component Type: Standard; Pin Count: 2; Value: 10k; Status: Not recommended; Power: 0.0625W; Tolerance: ±1%; Manufacturer Part Number: R0402_10K_1%_0.0625W_100PPM; Case: 0402; Mounted: Yes; Sense: No; Socket: No; SMD: Yes; Manufacturer1 Example: YAGEO PHYCOMP; Manufacturer1 ComponentHeight: 0.4mm; HelpURL: \\cern.ch\dfs\Applications\Altium\Datasheets\R0402_Phycomp_RC0402.pdf; Author: CERN DEM JLC; CreateDate: 03.12.2007; LatestRevisionDate: 17.10.2012
T1 = BSS138LT1G: N-CHANNEL MOSFET WITH DIODE; Part Description: 50V 200mA N-Channel Enhancement Mode Field-Effect Transistor; Manufacturer: ON SEMICONDUCTOR; PressFit: No; Bonding: No; Part Number: BSS138LT1G; Component Kind: Standard; Component Type: Standard; Device: BSS138LT1G; PackageDescription: SOT23 3-Leads, Pitch 0.95mm - Body 1.4x3mm, IPC Medium Density; Manufacturer Part Number: BSS138LT1G; Pin Count: 3; Case: SOT23-3; Mounted: Yes; Socket: No; SMD: Yes; Sense: No; ComponentHeight: 1.11mm; HelpURL: \\cern.ch\dfs\Applications\Altium\Datasheets\BSS138LT1G.pdf; Author: CERN DEM JLC; CreateDate: 23.03.2009; LatestRevisionDate: 23.03.2009

## Nets that join several sheets
GND: PCB_3U_RJ45 (57 pins), U_LVDS_repeater (6 pins), U_LVDS_repeater (6 pins), U_LVDS_repeater (6 pins), U_LVDS_repeater (6 pins), U_LVDS_repeater (6 pins), U_LVDS_repeater (6 pins), U_LVDS_repeater (6 pins), U_LVDS_repeater (6 pins), U_LVDS_repeater (6 pins), U_LVDS_repeater (6 pins), U_LVDS_repeater (6 pins), U_LVDS_repeater (6 pins), U_LVDS_repeater (6 pins), U_LVDS_repeater (6 pins), U_LVDS_repeater (6 pins), U_LVDS_repeater (6 pins)
P3V3: PCB_3U_RJ45 (42 pins), U_LVDS_repeater (5 pins), U_LVDS_repeater (5 pins), U_LVDS_repeater (5 pins), U_LVDS_repeater (5 pins), U_LVDS_repeater (5 pins), U_LVDS_repeater (5 pins), U_LVDS_repeater (5 pins), U_LVDS_repeater (5 pins), U_LVDS_repeater (5 pins), U_LVDS_repeater (5 pins), U_LVDS_repeater (5 pins), U_LVDS_repeater (5 pins), U_LVDS_repeater (5 pins), U_LVDS_repeater (5 pins), U_LVDS_repeater (5 pins), U_LVDS_repeater (5 pins)
LVDS1_N: PCB_3U_RJ45 (J1.3), U_LVDS_repeater (IC1P.1 IC2P.5 R2P.2)
LVDS1_P: PCB_3U_RJ45 (J1.2), U_LVDS_repeater (IC1P.8 IC2P.6 R2P.1)
LVDS2_N: PCB_3U_RJ45 (J1.6), U_LVDS_repeater (IC1O.1 IC2O.5 R2O.2)
LVDS2_P: PCB_3U_RJ45 (J1.5), U_LVDS_repeater (IC1O.8 IC2O.6 R2O.1)
LVDS3_N: PCB_3U_RJ45 (J1.9), U_LVDS_repeater (IC1N.1 IC2N.5 R2N.2)
LVDS3_P: PCB_3U_RJ45 (J1.8), U_LVDS_repeater (IC1N.8 IC2N.6 R2N.1)
LVDS4_N: PCB_3U_RJ45 (J1.12), U_LVDS_repeater (IC1M.1 IC2M.5 R2M.2)
LVDS4_P: PCB_3U_RJ45 (J1.11), U_LVDS_repeater (IC1M.8 IC2M.6 R2M.1)
LVDS5_N: PCB_3U_RJ45 (J1.15), U_LVDS_repeater (IC1L.1 IC2L.5 R2L.2)
LVDS5_P: PCB_3U_RJ45 (J1.14), U_LVDS_repeater (IC1L.8 IC2L.6 R2L.1)
LVDS6_N: PCB_3U_RJ45 (J1.18), U_LVDS_repeater (IC1K.1 IC2K.5 R2K.2)
LVDS6_P: PCB_3U_RJ45 (J1.17), U_LVDS_repeater (IC1K.8 IC2K.6 R2K.1)
LVDS7_N: PCB_3U_RJ45 (J1.21), U_LVDS_repeater (IC1J.1 IC2J.5 R2J.2)
LVDS7_P: PCB_3U_RJ45 (J1.20), U_LVDS_repeater (IC1J.8 IC2J.6 R2J.1)
LVDS8_N: PCB_3U_RJ45 (J1.24), U_LVDS_repeater (IC1I.1 IC2I.5 R2I.2)
LVDS8_P: PCB_3U_RJ45 (J1.23), U_LVDS_repeater (IC1I.8 IC2I.6 R2I.1)
LVDS9_N: PCB_3U_RJ45 (J3.3), U_LVDS_repeater (IC1H.1 IC2H.5 R2H.2)
LVDS9_P: PCB_3U_RJ45 (J3.2), U_LVDS_repeater (IC1H.8 IC2H.6 R2H.1)
LVDS10_N: PCB_3U_RJ45 (J3.6), U_LVDS_repeater (IC1G.1 IC2G.5 R2G.2)
LVDS10_P: PCB_3U_RJ45 (J3.5), U_LVDS_repeater (IC1G.8 IC2G.6 R2G.1)
LVDS11_N: PCB_3U_RJ45 (J3.9), U_LVDS_repeater (IC1F.1 IC2F.5 R2F.2)
LVDS11_P: PCB_3U_RJ45 (J3.8), U_LVDS_repeater (IC1F.8 IC2F.6 R2F.1)
LVDS12_N: PCB_3U_RJ45 (J3.12), U_LVDS_repeater (IC1E.1 IC2E.5 R2E.2)
LVDS12_P: PCB_3U_RJ45 (J3.11), U_LVDS_repeater (IC1E.8 IC2E.6 R2E.1)
LVDS13_N: PCB_3U_RJ45 (J3.15), U_LVDS_repeater (IC1D.1 IC2D.5 R2D.2)
LVDS13_P: PCB_3U_RJ45 (J3.14), U_LVDS_repeater (IC1D.8 IC2D.6 R2D.1)
LVDS14_N: PCB_3U_RJ45 (J3.18), U_LVDS_repeater (IC1C.1 IC2C.5 R2C.2)
LVDS14_P: PCB_3U_RJ45 (J3.17), U_LVDS_repeater (IC1C.8 IC2C.6 R2C.1)
LVDS15_N: PCB_3U_RJ45 (J3.21), U_LVDS_repeater (IC1B.1 IC2B.5 R2B.2)
LVDS15_P: PCB_3U_RJ45 (J3.20), U_LVDS_repeater (IC1B.8 IC2B.6 R2B.1)
LVDS16_N: PCB_3U_RJ45 (J3.24), U_LVDS_repeater (IC1A.1 IC2A.5 R2A.2)
LVDS16_P: PCB_3U_RJ45 (J3.23), U_LVDS_repeater (IC1A.8 IC2A.6 R2A.1)
NetIC1A_5: PCB_3U_RJ45 (J2.8D), U_LVDS_repeater (IC1A.5 IC2A.1 R1A.1)
NetIC1A_6: PCB_3U_RJ45 (J2.7D), U_LVDS_repeater (IC1A.6 IC2A.8 R1A.2)
NetIC1B_5: PCB_3U_RJ45 (J2.6D), U_LVDS_repeater (IC1B.5 IC2B.1 R1B.1)
NetIC1B_6: PCB_3U_RJ45 (J2.3D), U_LVDS_repeater (IC1B.6 IC2B.8 R1B.2)
NetIC1C_5: PCB_3U_RJ45 (J2.4D), U_LVDS_repeater (IC1C.5 IC2C.1 R1C.1)
NetIC1C_6: PCB_3U_RJ45 (J2.5D), U_LVDS_repeater (IC1C.6 IC2C.8 R1C.2)
NetIC1D_5: PCB_3U_RJ45 (J2.2D), U_LVDS_repeater (IC1D.5 IC2D.1 R1D.1)
NetIC1D_6: PCB_3U_RJ45 (J2.1D), U_LVDS_repeater (IC1D.6 IC2D.8 R1D.2)
NetIC1E_5: PCB_3U_RJ45 (J2.8C), U_LVDS_repeater (IC1E.5 IC2E.1 R1E.1)
NetIC1E_6: PCB_3U_RJ45 (J2.7C), U_LVDS_repeater (IC1E.6 IC2E.8 R1E.2)
NetIC1F_5: PCB_3U_RJ45 (J2.6C), U_LVDS_repeater (IC1F.5 IC2F.1 R1F.1)
NetIC1F_6: PCB_3U_RJ45 (J2.3C), U_LVDS_repeater (IC1F.6 IC2F.8 R1F.2)
NetIC1G_5: PCB_3U_RJ45 (J2.4C), U_LVDS_repeater (IC1G.5 IC2G.1 R1G.1)
NetIC1G_6: PCB_3U_RJ45 (J2.5C), U_LVDS_repeater (IC1G.6 IC2G.8 R1G.2)
NetIC1H_5: PCB_3U_RJ45 (J2.2C), U_LVDS_repeater (IC1H.5 IC2H.1 R1H.1)
NetIC1H_6: PCB_3U_RJ45 (J2.1C), U_LVDS_repeater (IC1H.6 IC2H.8 R1H.2)
NetIC1I_5: PCB_3U_RJ45 (J2.8B), U_LVDS_repeater (IC1I.5 IC2I.1 R1I.1)
NetIC1I_6: PCB_3U_RJ45 (J2.7B), U_LVDS_repeater (IC1I.6 IC2I.8 R1I.2)
NetIC1J_5: PCB_3U_RJ45 (J2.6B), U_LVDS_repeater (IC1J.5 IC2J.1 R1J.1)
NetIC1J_6: PCB_3U_RJ45 (J2.3B), U_LVDS_repeater (IC1J.6 IC2J.8 R1J.2)
NetIC1K_5: PCB_3U_RJ45 (J2.4B), U_LVDS_repeater (IC1K.5 IC2K.1 R1K.1)
NetIC1K_6: PCB_3U_RJ45 (J2.5B), U_LVDS_repeater (IC1K.6 IC2K.8 R1K.2)
NetIC1L_5: PCB_3U_RJ45 (J2.2B), U_LVDS_repeater (IC1L.5 IC2L.1 R1L.1)
NetIC1L_6: PCB_3U_RJ45 (J2.1B), U_LVDS_repeater (IC1L.6 IC2L.8 R1L.2)
NetIC1M_5: PCB_3U_RJ45 (J2.8A), U_LVDS_repeater (IC1M.5 IC2M.1 R1M.1)
NetIC1M_6: PCB_3U_RJ45 (J2.7A), U_LVDS_repeater (IC1M.6 IC2M.8 R1M.2)
NetIC1N_5: PCB_3U_RJ45 (J2.6A), U_LVDS_repeater (IC1N.5 IC2N.1 R1N.1)
NetIC1N_6: PCB_3U_RJ45 (J2.3A), U_LVDS_repeater (IC1N.6 IC2N.8 R1N.2)
NetIC1O_5: PCB_3U_RJ45 (J2.4A), U_LVDS_repeater (IC1O.5 IC2O.1 R1O.1)
NetIC1O_6: PCB_3U_RJ45 (J2.5A), U_LVDS_repeater (IC1O.6 IC2O.8 R1O.2)
NetIC1P_5: PCB_3U_RJ45 (J2.2A), U_LVDS_repeater (IC1P.5 IC2P.1 R1P.1)
NetIC1P_6: PCB_3U_RJ45 (J2.1A), U_LVDS_repeater (IC1P.6 IC2P.8 R1P.2)